# EAGLE schematic mcu (EAGLE 9.1.3)
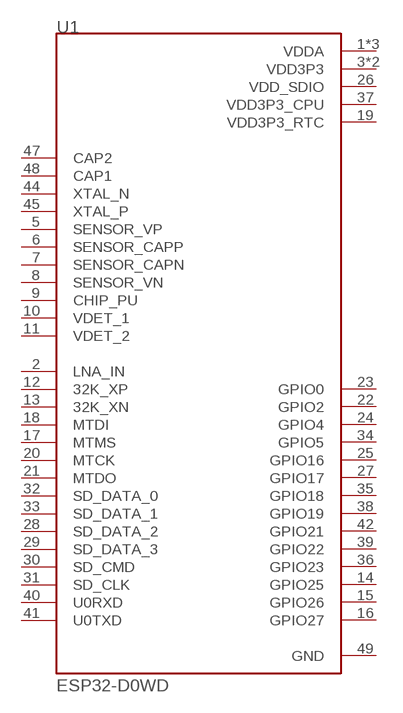
[diagram p0: schematic, sheet 1]

## Parts
U1  ESP32-D0WD  [QFN35P500X500X90-49N]
Unconnected: U1.2(LNA_IN) U1.5(SENSOR_VP) U1.6(SENSOR_CAPP) U1.7(SENSOR_CAPN) U1.8(SENSOR_VN) U1.9(CHIP_PU) U1.10(VDET_1) U1.11(VDET_2) U1.12(32K_XP) U1.13(32K_XN) U1.14(GPIO25) U1.15(GPIO26) U1.16(GPIO27) U1.17(MTMS) U1.18(MTDI) U1.20(MTCK) U1.21(MTDO) U1.22(GPIO2) U1.23(GPIO0) U1.24(GPIO4) U1.25(GPIO16) U1.27(GPIO17) U1.28(SD_DATA_2) U1.29(SD_DATA_3) U1.30(SD_CMD) U1.31(SD_CLK) U1.32(SD_DATA_0) U1.33(SD_DATA_1) U1.34(GPIO5) U1.35(GPIO18) U1.36(GPIO23) U1.38(GPIO19) U1.39(GPIO22) U1.40(U0RXD) U1.41(U0TXD) U1.42(GPIO21) U1.44(XTAL_N) U1.45(XTAL_P) U1.47(CAP2) U1.48(CAP1)

## Power pins joined to a net without a drawn wire
GND: U1.49(GND)
VDD3P3: U1.3(VDD3P3) U1.4(VDD3P3)
VDD3P3_CPU: U1.37(VDD3P3_CPU)
VDD3P3_RTC: U1.19(VDD3P3_RTC)
VDD_SDIO: U1.26(VDD_SDIO)
VDDA: U1.1(VDDA) U1.43(VDDA) U1.46(VDDA)

## Library data of the parts
U1 = ESP32-D0WD:ESP32-D0WD: ESP32 is a single 2.4 GHz Wi-Fi-and-Bluetooth combo chip designed with the TSMC ultra-low-power 40 nm technology. It is designed to achieve the best power and RF performance, showing robustness, versatility and reliability in a wide variety of applications and power scenarios.; AVAILABILITY: Unavailable; DESCRIPTION: Smd Ic Esp32-D0wd, Dual Core Mcu; MF: Espressif Systems; MP: ESP32-D0WD; PACKAGE: VFQFN-48 Espressif Systems; PRICE: None